# Altium schematic sheet cs301_07.SchDoc
size A4
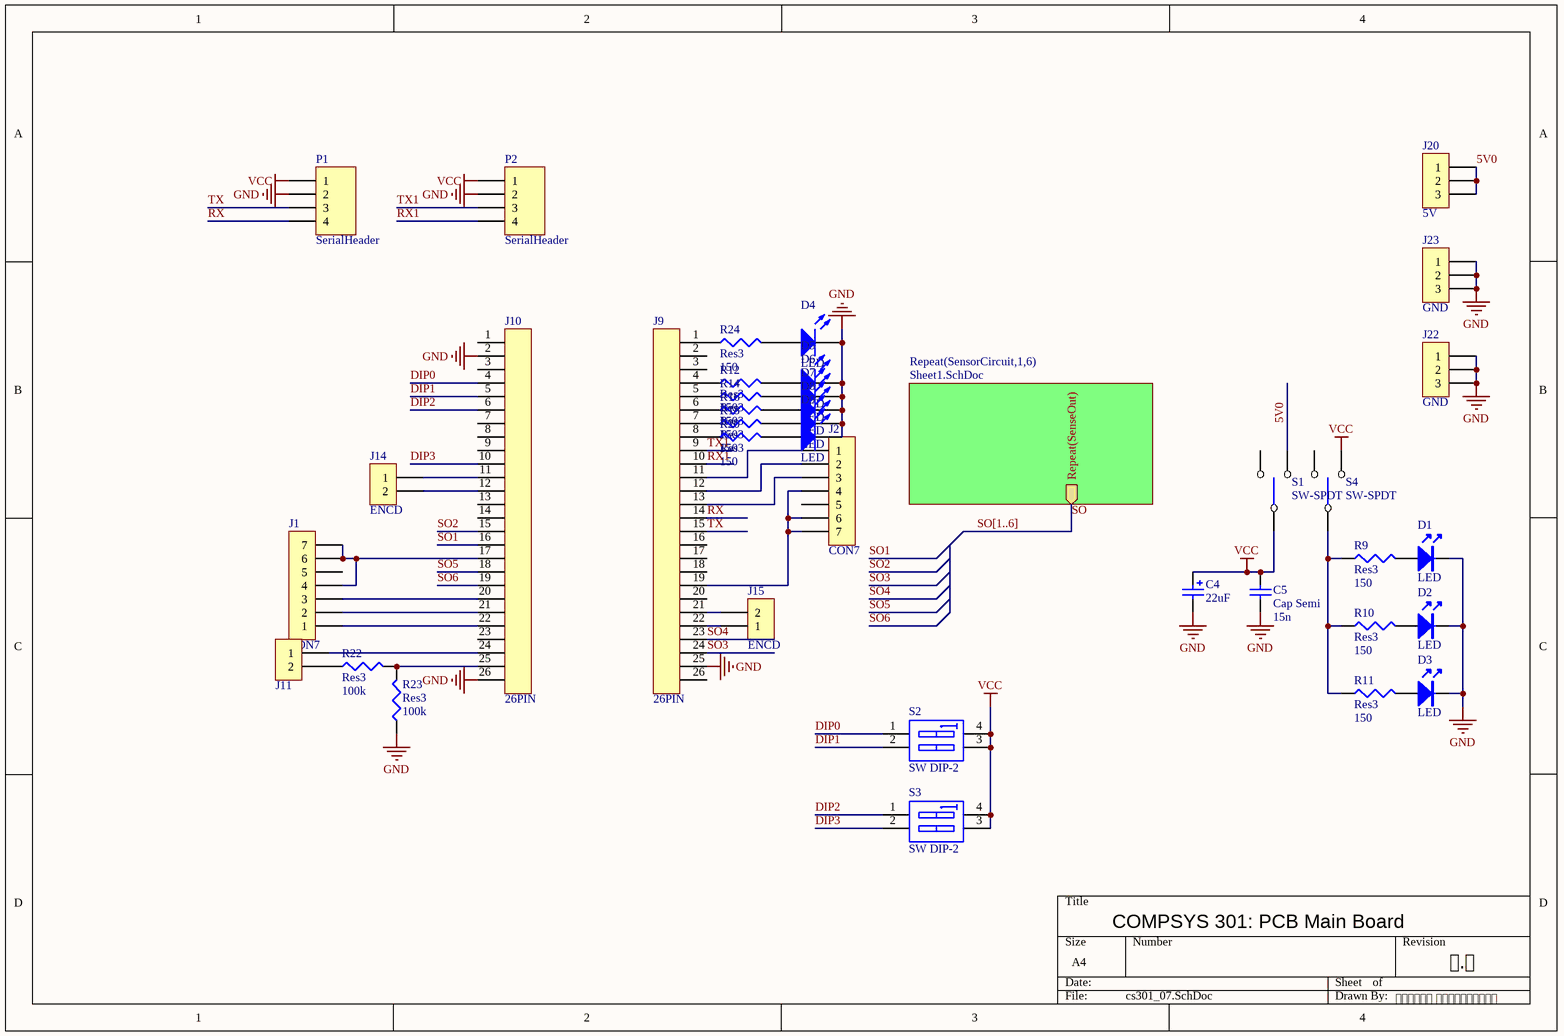
[diagram p0: cs301_07.SchDoc]

## Parts
C4  22uF  [ECE-CAPAE6.3X5.4SM]
C5  Cap Semi  value 15n  [1608[0603]]
D1  LED  [LED0.1/5MM]
D2  LED  [LED0.1/5MM]
D3  LED  [LED0.1/5MM]
D4  LED  [ECE-LED2012-0805SM]
D5  LED  [ECE-LED2012-0805SM]
D6  LED  [ECE-LED2012-0805SM]
D7  LED  [ECE-LED2012-0805SM]
D8  LED  [ECE-LED2012-0805SM]
D9  LED  [ECE-LED2012-0805SM]
J1  CON7  [SIP7]
J2  CON7  [SIP7]
J9  26PIN  [SIP26]
J10  26PIN  [SIP26]
J11  Battery  [sip2]  (value not drawn)
J14  ENCD  [sip2]
J15  ENCD  [sip2]
J20  5V  [sip3]
J22  GND  [sip3]
J23  GND  [sip3]
P1  SerialHeader  [HDR1X4]
P2  SerialHeader  [HDR1X4]
R9  Res3  value 150  [J1-0603]
R10  Res3  value 150  [J1-0603]
R11  Res3  value 150  [J1-0603]
R12  Res3  value 150  [J1-0603]
R14  Res3  value 150  [J1-0603]
R16  Res3  value 150  [J1-0603]
R18  Res3  value 150  [J1-0603]
R20  Res3  value 150  [J1-0603]
R22  Res3  value 100k  [J1-0603]
R23  Res3  value 100k  [J1-0603]
R24  Res3  value 150  [J1-0603]
S1  SW-SPDT  [SW-SPDT]
S2  SW DIP-2  [DIP-4]
S3  SW DIP-2  [DIP-4]
S4  SW-SPDT  [SW-SPDT]

## Sub-sheets
Repeat(SensorCircuit,1,6) = Sheet1.SchDoc: Repeat(SenseOut) (out)

## Nets
GND: C4.2 C5.1 D1.K D2.K D3.K D4.2(K) D5.2(K) D6.2(K) D7.2(K) D8.2(K) D9.2(K) J9.25 J10.2 J10.26 J22.1 J22.2 J22.3 J23.1 J23.2 J23.3 P1.2 P2.2 R23.1
VCC: C4.1 C5.2 P1.1 P2.1 S1.2 S2.3(B2) S2.4(B1) S3.3(B2) S3.4(B1) S4.3
5V0: J20.1 J20.2 J20.3 S1.3
DIP0: J10.4 S2.1(A1)
DIP1: J10.5 S2.2(A2)
DIP2: J10.6 S3.1(A1)
DIP3: J10.10 S3.2(A2)
RX: J9.14 P1.4
RX1: J9.10 P2.4
SO: sheet Repeat(SensorCircuit,1,6)/Repeat(SenseOut)
SO1: J10.16
SO2: J10.15
SO3: J9.24
SO4: J9.23
SO5: J10.18
SO6: J10.19
TX: J9.15 P1.3
TX1: J9.9 P2.3
NetD1_A: D1.A R9.2
NetD2_A: D2.A R10.2
NetD3_A: D3.A R11.2
NetD4_1: D4.1(A) R24.2
NetD5_1: D5.1(A) R12.2
NetD6_1: D6.1(A) R14.2
NetD7_1: D7.1(A) R16.2
NetD8_1: D8.1(A) R18.2
NetD9_1: D9.1(A) R20.2
NetJ1_1: J1.1 J10.22
NetJ1_2: J1.2 J10.21
NetJ1_3: J1.3 J10.20
NetJ1_4: J1.4 J1.6 J1.7 J10.17
NetJ2_1: J2.1 J9.11
NetJ2_2: J2.2 J9.12
NetJ2_3: J2.3 J9.13
NetJ2_4: J2.4 J2.6 J2.7 J9.19
NetJ9_1: J9.1 R24.1
NetJ9_4: J9.4 R12.1
NetJ9_5: J9.5 R14.1
NetJ9_6: J9.6 R16.1
NetJ9_7: J9.7 R18.1
NetJ9_8: J9.8 R20.1
NetJ9_21: J9.21 J15.2
NetJ9_22: J9.22 J15.1
NetJ10_11: J10.11 J14.1
NetJ10_12: J10.12 J14.2
NetJ10_24: J10.24 J11.1
NetJ10_25: J10.25 R22.2 R23.2
NetJ11_2: J11.2 R22.1
NetR9_1: R9.1 R10.1 R11.1 S4.2

Not connected (* = marked no-connect by the designer): J1 5; J2 5; J9 2 3 16 17 18 20 26; J10 1 3 7 8 9 13 14 23; S1 1; S4 1

## Buses and harness runs
bus SO[1..6]

## Notes on the sheet
- COMPSYS 301: PCB Main Board
- ௧.௦
- சகாயன் சிற்சபேசன்

## Library data of the parts
C4 = CAP 22uF/35V SM: Polarized Capacitor (Radial); Revision: July-2002: Re-released for DXP Platform.; Value: 22uF
C5 = Cap Semi: Capacitor (Semiconductor SIM Model); Published: 8-Jun-2000; LatestRevisionDate: 29-May-2009; LatestRevisionNote: IPC-7351 Footprint Added.; PackageReference: C1206; Publisher: Altium Limited; PackageDescription: Chip Capacitor
D4-D9 = DIO000104: LED GREEN CLEAR 0805 SM; UoA Stock#: DIO000104
J1 J2 = CON7: Connector
J11 J14 J15 = CON2: Connector
J20 J22 J23 = CON3: Connector
P1 P2 = Header 4: Header, 4-Pin; LatestRevisionDate: 17-Jul-2002; LatestRevisionNote: Re-released for DXP Platform.; Publisher: Altium Limited
R9-R12 R14 R16 R18 R20 R22-R24 = Res3: Resistor; Published: 8-Jun-2000; LatestRevisionDate: 29-May-2009; LatestRevisionNote: IPC-7351 Footprint Added.; PackageReference: J1-0603; Publisher: Altium Limited; PackageDescription: Chip Resistor
S1 S4 = SW-SPDT: Toggle Switch
S2 S3 = SW DIP-2: DIP Switch, 2 Position, SPST; Published: 24-Mar-1999; LatestRevisionDate: 17-Jul-2002; LatestRevisionNote: Re-released for DXP Platform.; PackageReference: DIP-4; Publisher: Altium Limited